# Altium project PROJECT_DATKLL2.PrjPcb
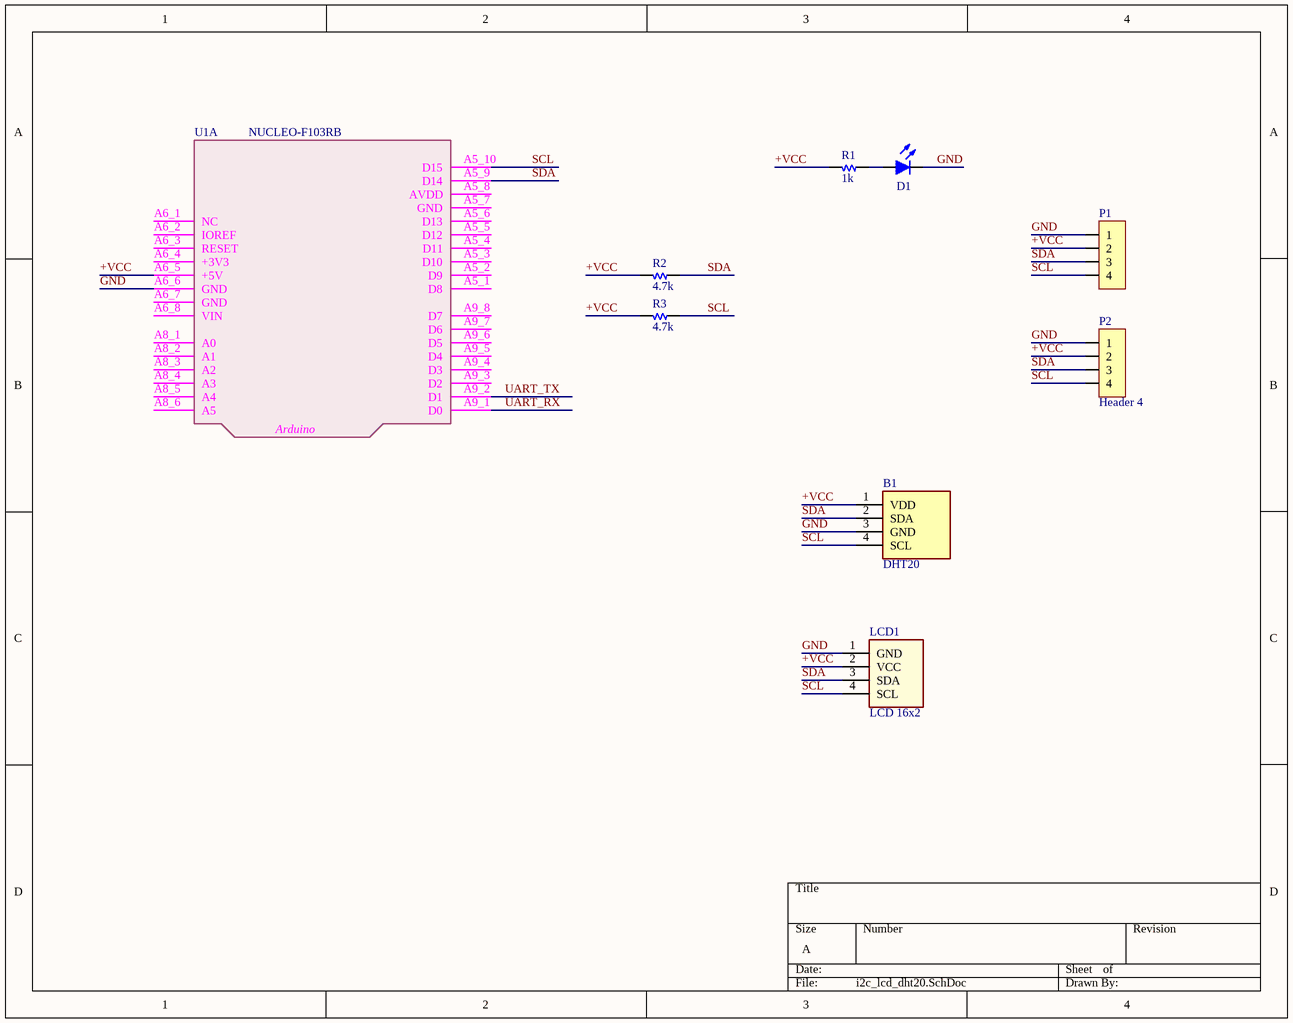
[diagram p0: i2c_lcd_dht20.SchDoc]
1 sheet, 9 parts. Net scope: global (net labels, ports and power ports of the same name join across sheets).
Board file: PCB1_I2C_datkll.PcbDoc

## Sheet i2c_lcd_dht20.SchDoc
size A; SheetNumber: 1; SheetTotal: 1

### Parts
B1  DHT20  [SEN18364]
D1  Led  [LED 3MM - red]  (value not drawn)
LCD1  LCD 16x2  [LCD 1602A I2C]
P1  (no value)  [HDR/Header/4/2mm/BOX]
P2  Header 4  [HDR/Header/4/2mm/BOX]
R1  1k  [R 1/4W/300]
R2  4.7k  [R 1/4W/300]
R3  4.7k  [R 1/4W/300]
U1  NUCLEO-F103RB  [NUCLEO]  (part A of 3)

### Nets
+VCC: B1.1(VDD) LCD1.2(VCC) P1.2 P2.2 R1.2 R2.2 R3.2 U1.A6_5(+5V)
GND: B1.3(GND) D1.2(K) LCD1.1(GND) P1.1 P2.1 U1.A6_6(GND)
SCL: B1.4(SCL) LCD1.4(SCL) P1.4 P2.4 R3.1 U1.A5_10(D15)
SDA: B1.2(SDA) LCD1.3(SDA) P1.3 P2.3 R2.1 U1.A5_9(D14)
UART_RX: U1.A9_1(D0)
UART_TX: U1.A9_2(D1)
NetD1_1: D1.1(A) R1.1

Not connected (* = marked no-connect by the designer): U1 A5_1(D8) A5_2(D9) A5_3(D10) A5_4(D11) A5_5(D12) A5_6(D13) A5_7(GND) A5_8(AVDD) A6_1(NC) A6_2(IOREF) A6_3(RESET) A6_4(+3V3) A6_7(GND) A6_8(VIN) A8_1(A0) A8_2(A1) A8_3(A2) A8_4(A3) A8_5(A4) A8_6(A5) A9_3(D2) A9_4(D3) A9_5(D4) A9_6(D5) A9_7(D6) A9_8(D7)

### Notes on the sheet
- (in symbol NUCLEO-F103RB, part A) Arduino

### Library data of the parts
B1 = SEN-18364: Multiple Function Sensor Modules Humidity and Temperature Sensor - DHT20; Manufacturer_Name: SparkFun; Geometry.Height: 16.3mm; Manufacturer_Part_Number: SEN-18364; Mouser Part Number: 474-SEN-18364; Mouser Price/Stock: https://www.mouser.co.uk/ProductDetail/SparkFun/SEN-18364?qs=QNEnbhJQKvbVltiDzPDFyg%3D%3D; Arrow Part Number: *; Arrow Price/Stock: *; Datasheet Link: https://cdn.sparkfun.com/assets/8/a/1/5/0/DHT20.pdf
D1 = Led: Typical LED
LCD1 = LCD 16x2: Character LCD 16x2
P1 P2 = Header 4: Header, 4-Pin
R1-R3 = Resistor
U1 = NUCLEO-F103RB: STM32F103RB, mbed-Enabled Development Nucleo-64 STM32F1 ARM® Cortex®-M3 MCU 32-Bit Embedded Evaluation Board; Manufacturer: STMicroelectronics; Manufacturer Product Number: NUCLEO-F103RB; BRAND: STMicroelectronics; PART NO: NUCLEO-F103RB; STOCK CODE: 497-14362-ND; SUPPLIER: digi-key; TYPE: EVAL BRD